# Altium schematic sheet SWD_Adapter.SchDoc: SWD Adapter Board
size A4; DrawnBy: Norman Chong; Revision: 1.3
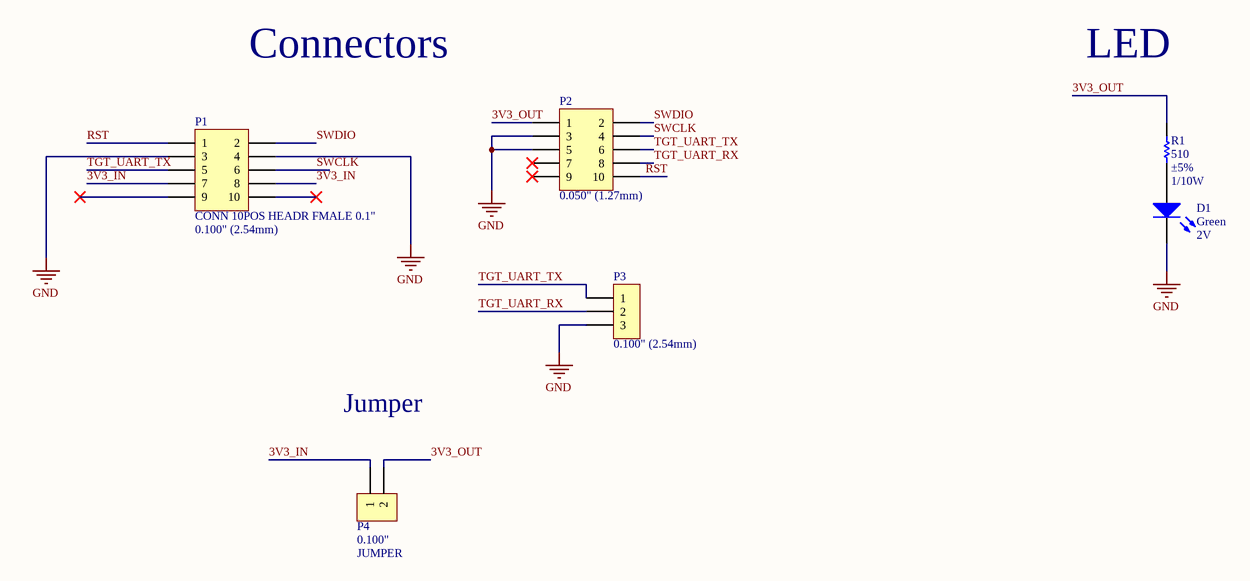
[diagram p0: SWD_Adapter.SchDoc]

## Parts
D1  Color: Green  Voltage - Forward (Vf) (Typ): 2V  [LED_0603]  (hidden comment: LED GREEN CLEAR 2V 0603)
P1  CONN 10POS HEADR FMALE 0.1"  Pitch - Mating: 0.100" (2.54mm)  [CONN ,10 POS Header 0.100"]
P2  Pitch - Mating: 0.050" (1.27mm)  [CONN, 10POS 0.05" Debug Header]  (hidden comment: CONN 10POS HEADR MALE 0.05")
P3  Pitch - Mating: 0.100" (2.54mm)  (hidden comment: CONN 3POS HEADR MALE 0.1")
P4  Row Spacing - Mating: 0.100"  [CONN 2POS JUMPER 0.1"]  (hidden comment: JUMPER)
R1  Resistance: 510  Tolerance: ±5%  Power: 1/10W  [RES, 0603]  (hidden comment: RES 510 OHM 5% 1/10W 0603)

## Nets
GND: D1.2(K) P1.3 P1.4 P2.3 P2.5 P3.3
3V3_IN: P1.7 P1.8 P4.1
3V3_OUT: P2.1 P4.2 R1.1
RST: P1.1 P2.10
SWCLK: P1.6 P2.4
SWDIO: P1.2 P2.2
TGT_UART_RX: P2.8 P3.2
TGT_UART_TX: P1.5 P2.6 P3.1
NetD1_1: D1.1(A) R1.2

Not connected (* = marked no-connect by the designer): P1 9* 10*; P2 7* 9*

## Notes on the sheet
- Connectors
- LED
- Jumper

## Library data of the parts
D1 = LED GREEN CLEAR 2V 0603: Green 572nm LED Indication - Discrete 2V 0603 (1608 Metric); Manufacturer: Wurth Electronics Inc.; Manufacturer Part Number: 150060VS75000; Lens Color: Colorless; Millicandela Rating: 40mcd; Lens Style/Size: Rectangle with Flat Top, 1.10mm x 0.70mm; Current - Test: 20mA; Viewing Angle: 140°; Wavelength - Dominant: 570nm; Supplier 1: Digi-Key; Supplier Part Number 1: 732-4980-1-ND; RoHS: RoHS Compliant; Category: Optoelectronics; Stock 1: 9408; Pricing 1: 1=0.21, 100=0.1617, 500=0.13964 (CAD); Packaging: Cut Tape (CT); Part Status: Active; Lens Transparency: Clear; Mounting Type: Surface Mount; Wavelength - Peak: 572nm; Features: -; Package / Case: 0603 (1608 Metric); Supplier Device Package: 0603; Size / Dimension: 1.60mm L x 0.80mm W; Height (Max): 0.80mm; ComponentLink1URL: http://katalog.we-online.de/led/datasheet/150060VS75000.pdf; ComponentLink1Description: http://katalog.we-online.de/led/datasheet/150060VS75000.pdf
P1 = CONN 10POS HEADR FMALE 0.1": 10 Position Header Connector 0.100" (2.54mm) Through Hole, Right Angle Gold; Manufacturer 1: Sullins Connector Solutions; Manufacturer Part Number 1: SFH11-PBPC-D05-RA-BK; Style: Board to Board; Number of Positions: 10; Number of Positions Loaded: All; Contact Length - Post: 0.106" (2.69mm); Material Flammability Rating: UL94 V-0; Current Rating: 3A; Supplier 1: Digi-Key; Supplier Part Number 1: S9202-ND; Packaging: Tray; Part Status: Active; Connector Type: Header; Contact Type: Female Socket; Number of Rows: 2; Row Spacing - Mating: 0.100" (2.54mm); Mounting Type: Through Hole, Right Angle; Termination: Solder; Fastening Type: Push-Pull; Contact Finish - Mating: Gold; Contact Finish Thickness - Mating: Flash; Insulation Color: Black; Insulation Height: 0.236" (6.00mm); Operating Temperature: -40°C ~ 105°C; Contact Finish - Post: Gold; Mated Stacking Heights: -; Ingress Protection: -; Insulation Material: Polybutylene Terephthalate (PBT); Contact Shape: Square; Contact Material: Brass; Contact Finish Thickness - Post: Flash; ComponentLink1URL: http://sullinscorp.com/catalogs/147_PAGE119_.100_SFH11_SERIES_FEMALE_HDR_ST_RA.pdf; ComponentLink1Description: http://sullinscorp.com/catalogs/147_PAGE119_.100_SFH11_SERIES_FEMALE_HDR_ST_RA.pdf; Voltage: -
P2 = CONN 10POS HEADR MALE 0.05": 10 Positions Header Connector 0.050" (1.27mm) Surface Mount Gold; Manufacturer 1: Amphenol FCI; Manufacturer Part Number 1: 20021121-00010C4LF; Style: Board to Board; Shrouding: Unshrouded; Number of Positions: 10; Number of Positions Loaded: All; Contact Length - Mating: 0.120" (3.05mm); Material Flammability Rating: UL94 V-0; Supplier 1: Digi-Key; Supplier Part Number 1: 609-3695-1-ND; Packaging: Cut Tape (CT); Part Status: Active; Connector Type: Header; Contact Type: Male Pin; Number of Rows: 2; Row Spacing - Mating: 0.050" (1.27mm); Mounting Type: Surface Mount; Termination: Solder; Fastening Type: -; Contact Length - Post: -; Overall Contact Length: -; Insulation Height: -; Contact Shape: Square; Contact Finish - Mating: Gold; Contact Finish Thickness - Mating: 10µin (0.25µm); Contact Finish - Post: Tin; Contact Material: Copper Alloy; Insulation Material: Thermoplastic; Operating Temperature: -; Ingress Protection: -; Insulation Color: Black; Current Rating: -; Mated Stacking Heights: -; Contact Finish Thickness - Post: 50µin (1.27µm); ComponentLink1URL: http://portal.fciconnect.com/Comergent//fci/drawing/20021121.pdf; ComponentLink1Description: http://portal.fciconnect.com/Comergent//fci/drawing/20021121.pdf; Voltage: -
P3 = CONN 3POS HEADR MALE 0.1": 3 Positions Header Connector 0.100" (2.54mm) Through Hole Gold; Manufacturer 1: Wurth Electronics Inc.; Manufacturer Part Number 1: 61300311121; Style: Board to Board or Cable; Shrouding: Unshrouded; Number of Positions: 3; Number of Positions Loaded: All; Contact Length - Mating: 0.236" (6.00mm); Contact Length - Post: 0.118" (3.00mm); Overall Contact Length: 0.454" (11.54mm); Material Flammability Rating: UL94 V-0; Current Rating: 3A; Voltage: 250V; Supplier 1: Digi-Key; Supplier Part Number 1: 732-5316-ND; Packaging: Bulk; Part Status: Active; Connector Type: Header; Contact Type: Male Pin; Number of Rows: 1; Row Spacing - Mating: -; Mounting Type: Through Hole; Termination: Solder; Fastening Type: -; Insulation Height: 0.100" (2.54mm); Contact Shape: Square; Contact Finish - Mating: Gold; Contact Finish Thickness - Mating: -; Contact Finish - Post: -; Contact Material: Copper Alloy; Insulation Material: Polybutylene Terephthalate (PBT); Operating Temperature: -40°C ~ 125°C; Ingress Protection: -; Insulation Color: Black; Mated Stacking Heights: -; Contact Finish Thickness - Post: -; ComponentLink1URL: http://katalog.we-online.de/em/datasheet/6130xx11121.pdf; ComponentLink1Description: http://katalog.we-online.de/em/datasheet/6130xx11121.pdf
P4 = CONN 2POS JUMPER 0.1": 2 Positions Header Connector Through Hole Gold; Manufacturer: Omron Electronics Inc-EMC Div; Manufacturer Part Number: XG8T-0231; Style: Board to Board or Cable; Shrouding: Unshrouded; Number of Positions: 2; Number of Positions Loaded: All; Contact Length - Mating: 0.169" (4.30mm); Contact Length - Post: 0.118" (3.00mm); Overall Contact Length: 0.386" (9.80mm); Material Flammability Rating: UL94 V-0; Current Rating: 2A; Voltage Rating: 300V; Supplier 1: Digi-Key; Supplier Part Number 1: XG8T-0231-ND; RoHS: RoHS Compliant; Category: Connectors, Interconnects; Stock 1: 9094; Pricing 1: 1=0.28, 10=0.265, 100=0.183, 500=0.15484, 1000=0.12668, 5000=0.11261, 10000=0.10205 (CAD); Packaging: Bulk; Part Status: Active; Connector Type: Header; Contact Type: Male Pin; Pitch - Mating: -; Number of Rows: 2; Mounting Type: Through Hole; Termination: Solder; Fastening Type: -; Insulation Height: 0.098" (2.50mm); Contact Shape: Square; Contact Finish - Mating: Gold; Contact Finish Thickness - Mating: 5.9µin (0.15µm); Contact Finish - Post: Tin; Contact Material: Brass, Nickel; Insulation Material: Polybutylene Terephthalate (PBT), Glass Filled; Features: -; Operating Temperature: -55°C ~ 105°C; Ingress Protection: -; Insulation Color: Black; Mated Stacking Heights: -; Contact Finish Thickness - Post: -; Applications: -; ComponentLink1URL: http://www.omron.com/ecb/products/pdf/en-xj8.pdf; ComponentLink1Description: http://www.omron.com/ecb/products/pdf/en-xj8.pdf; Type: JUMPER
R1 = RES 510 OHM 5% 1/10W 0603: RES SMD 510 OHM 5% 1/10W 0603; Manufacturer 1: Yageo; Manufacturer Part Number 1: RC0603JR-07510RL; Temperature Coefficient: ±100ppm/°C; Supplier 1: Digi-Key; Supplier Part Number 1: 311-510GRCT-ND; Packaging: Cut Tape (CT); Part Status: Active; Composition: Thick Film; Operating Temperature: -55°C ~ 155°C; Package / Case: 0603 (1608 Metric); Supplier Device Package: 0603; Size / Dimension: 0.063" L x 0.031" W (1.60mm x 0.80mm); Height - Seated (Max): 0.022" (0.55mm); Failure Rate: -; ComponentLink1URL: http://www.yageo.com/documents/recent/PYu-RC_Group_51_RoHS_L_7.pdf; ComponentLink1Description: http://www.yageo.com/documents/recent/PYu-RC_Group_51_RoHS_L_7.pdf